# Altium schematic sheet 心形流水灯原理图.SchDoc
size A4
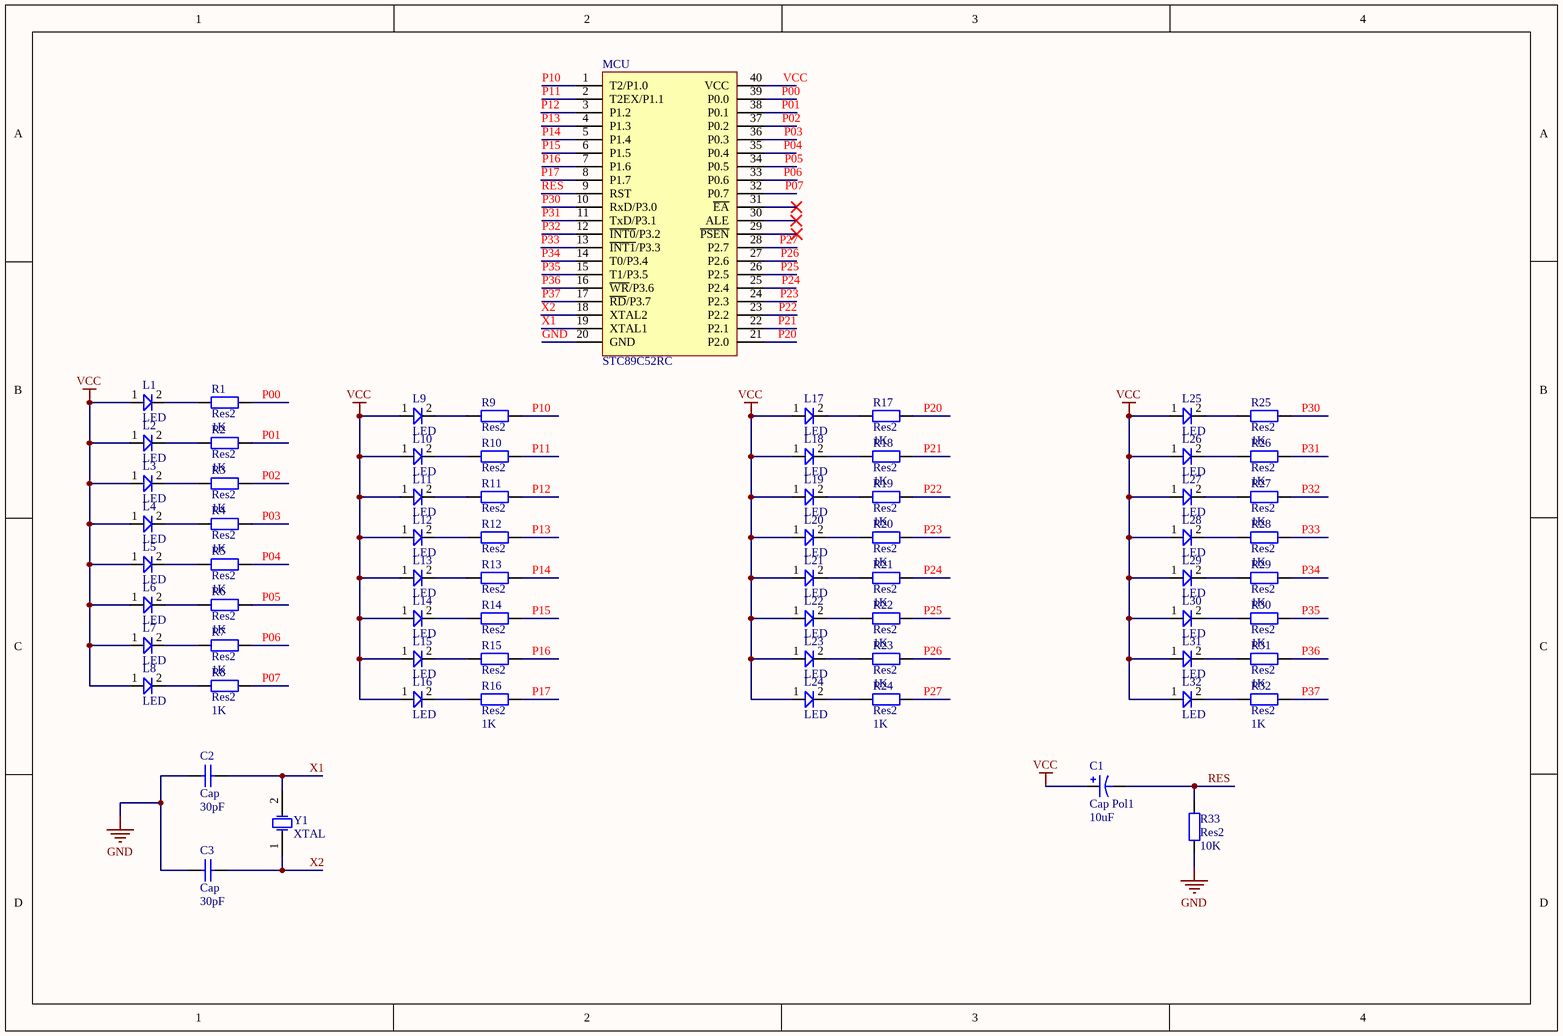
[diagram p0: 心形流水灯原理图.SchDoc]

## Parts
C1  Cap Pol1  value 10uF  [CAP-SMD_BD5.0-L5.3-W5.3-FD]
C2  Cap  value 30pF  [C0603]
C3  Cap  value 30pF  [C0603]
L1  LED  [LED-TH_BD5.6-P2.54-FD]
L2  LED  [LED-TH_BD5.6-P2.54-FD]
L3  LED  [LED-TH_BD5.6-P2.54-FD]
L4  LED  [LED-TH_BD5.6-P2.54-FD]
L5  LED  [LED-TH_BD5.6-P2.54-FD]
L6  LED  [LED-TH_BD5.6-P2.54-FD]
L7  LED  [LED-TH_BD5.6-P2.54-FD]
L8  LED  [LED-TH_BD5.6-P2.54-FD]
L9  LED  [LED-TH_BD5.6-P2.54-FD]
L10  LED  [LED-TH_BD5.6-P2.54-FD]
L11  LED  [LED-TH_BD5.6-P2.54-FD]
L12  LED  [LED-TH_BD5.6-P2.54-FD]
L13  LED  [LED-TH_BD5.6-P2.54-FD]
L14  LED  [LED-TH_BD5.6-P2.54-FD]
L15  LED  [LED-TH_BD5.6-P2.54-FD]
L16  LED  [LED-TH_BD5.6-P2.54-FD]
L17  LED  [LED-TH_BD5.6-P2.54-FD]
L18  LED  [LED-TH_BD5.6-P2.54-FD]
L19  LED  [LED-TH_BD5.6-P2.54-FD]
L20  LED  [LED-TH_BD5.6-P2.54-FD]
L21  LED  [LED-TH_BD5.6-P2.54-FD]
L22  LED  [LED-TH_BD5.6-P2.54-FD]
L23  LED  [LED-TH_BD5.6-P2.54-FD]
L24  LED  [LED-TH_BD5.6-P2.54-FD]
L25  LED  [LED-TH_BD5.6-P2.54-FD]
L26  LED  [LED-TH_BD5.6-P2.54-FD]
L27  LED  [LED-TH_BD5.6-P2.54-FD]
L28  LED  [LED-TH_BD5.6-P2.54-FD]
L29  LED  [LED-TH_BD5.6-P2.54-FD]
L30  LED  [LED-TH_BD5.6-P2.54-FD]
L31  LED  [LED-TH_BD5.6-P2.54-FD]
L32  LED  [LED-TH_BD5.6-P2.54-FD]
MCU  STC89C52RC  [DIP-40_L50.8-W17.8-P2.54-LS15.2-BL]
R1  Res2  value 1K  [R0603]
R2  Res2  value 1K  [R0603]
R3  Res2  value 1K  [R0603]
R4  Res2  value 1K  [R0603]
R5  Res2  value 1K  [R0603]
R6  Res2  value 1K  [R0603]
R7  Res2  value 1K  [R0603]
R8  Res2  value 1K  [R0603]
R9  Res2  [R0603]
R10  Res2  [R0603]
R11  Res2  [R0603]
R12  Res2  [R0603]
R13  Res2  [R0603]
R14  Res2  [R0603]
R15  Res2  [R0603]
R16  Res2  value 1K  [R0603]
R17  Res2  value 1K  [R0603]
R18  Res2  value 1K  [R0603]
R19  Res2  value 1K  [R0603]
R20  Res2  value 1K  [R0603]
R21  Res2  value 1K  [R0603]
R22  Res2  value 1K  [R0603]
R23  Res2  value 1K  [R0603]
R24  Res2  value 1K  [R0603]
R25  Res2  value 1K  [R0603]
R26  Res2  value 1K  [R0603]
R27  Res2  value 1K  [R0603]
R28  Res2  value 1K  [R0603]
R29  Res2  value 1K  [R0603]
R30  Res2  value 1K  [R0603]
R31  Res2  value 1K  [R0603]
R32  Res2  value 1K  [R0603]
R33  Res2  value 10K  [R0603]
Y1  XTAL  [HC-49S_L11.4-W4.8]

## Nets
GND: C2.1 C3.1 MCU.20(GND) R33.1
VCC: C1.1 L1.1 L2.1 L3.1 L4.1 L5.1 L6.1 L7.1 L8.1 L9.1 L10.1 L11.1 L12.1 L13.1 L14.1 L15.1 L16.1 L17.1 L18.1 L19.1 L20.1 L21.1 L22.1 L23.1 L24.1 L25.1 L26.1 L27.1 L28.1 L29.1 L30.1 L31.1 L32.1 MCU.40(VCC)
P00: MCU.39(P0.0) R1.2
P01: MCU.38(P0.1) R2.2
P02: MCU.37(P0.2) R3.2
P03: MCU.36(P0.3) R4.2
P04: MCU.35(P0.4) R5.2
P05: MCU.34(P0.5) R6.2
P06: MCU.33(P0.6) R7.2
P07: MCU.32(P0.7) R8.2
P10: MCU.1(T2/P1.0) R9.2
P11: MCU.2(T2EX/P1.1) R10.2
P12: MCU.3(P1.2) R11.2
P13: MCU.4(P1.3) R12.2
P14: MCU.5(P1.4) R13.2
P15: MCU.6(P1.5) R14.2
P16: MCU.7(P1.6) R15.2
P17: MCU.8(P1.7) R16.2
P20: MCU.21(P2.0) R17.2
P21: MCU.22(P2.1) R18.2
P22: MCU.23(P2.2) R19.2
P23: MCU.24(P2.3) R20.2
P24: MCU.25(P2.4) R21.2
P25: MCU.26(P2.5) R22.2
P26: MCU.27(P2.6) R23.2
P27: MCU.28(P2.7) R24.2
P30: MCU.10(RxD/P3.0) R25.2
P31: MCU.11(TxD/P3.1) R26.2
P32: MCU.12(~{INT0}/P3.2) R27.2
P33: MCU.13(~{INT1}/P3.3) R28.2
P34: MCU.14(T0/P3.4) R29.2
P35: MCU.15(T1/P3.5) R30.2
P36: MCU.16(~{WR}/P3.6) R31.2
P37: MCU.17(~{RD}/P3.7) R32.2
RES: C1.2 MCU.9(RST) R33.2
X1: C2.2 MCU.19(XTAL1) Y1.2(OSC2)
X2: C3.2 MCU.18(XTAL2) Y1.1(OSC1)
NetL1_2: L1.2 R1.1
NetL2_2: L2.2 R2.1
NetL3_2: L3.2 R3.1
NetL4_2: L4.2 R4.1
NetL5_2: L5.2 R5.1
NetL6_2: L6.2 R6.1
NetL7_2: L7.2 R7.1
NetL8_2: L8.2 R8.1
NetL9_2: L9.2 R9.1
NetL10_2: L10.2 R10.1
NetL11_2: L11.2 R11.1
NetL12_2: L12.2 R12.1
NetL13_2: L13.2 R13.1
NetL14_2: L14.2 R14.1
NetL15_2: L15.2 R15.1
NetL16_2: L16.2 R16.1
NetL17_2: L17.2 R17.1
NetL18_2: L18.2 R18.1
NetL19_2: L19.2 R19.1
NetL20_2: L20.2 R20.1
NetL21_2: L21.2 R21.1
NetL22_2: L22.2 R22.1
NetL23_2: L23.2 R23.1
NetL24_2: L24.2 R24.1
NetL25_2: L25.2 R25.1
NetL26_2: L26.2 R26.1
NetL27_2: L27.2 R27.1
NetL28_2: L28.2 R28.1
NetL29_2: L29.2 R29.1
NetL30_2: L30.2 R30.1
NetL31_2: L31.2 R31.1
NetL32_2: L32.2 R32.1

Not connected (* = marked no-connect by the designer): MCU 29(~{PSEN})* 30(ALE)* 31(~{EA})*

## Library data of the parts
C1 = Cap Pol1: Polarized Capacitor (Radial); Published: 8-Jun-2000; LatestRevisionDate: 17-Jul-2002; LatestRevisionNote: Re-released for DXP Platform.; PackageReference: RB7.6-15; Publisher: Altium Limited
C2 C3 = Cap: Capacitor; Published: 8-Jun-2000; LatestRevisionDate: 17-Jul-2002; LatestRevisionNote: Re-released for DXP Platform.; PackageReference: RAD-0.3; Publisher: Altium Limited
L1-L32 = LED_T
MCU = STC89C52RC: STC单片机; 版权归属: 源创客; BOM名称: STC单片机; 学习资源: www.ooocke.com
R1-R33 = Res2: Resistor; Published: 8-Jun-2000; LatestRevisionDate: 17-Jul-2002; LatestRevisionNote: Re-released for DXP Platform.; PackageReference: AXIAL-0.4; Publisher: Altium Limited
  R1-R32: PackageDescription: Axial Device, Thru-Hole; 2 Leads; 0.4 in Pin Spacing
Y1 = XTAL: Crystal Oscillator; Published: 8-Jun-2000; LatestRevisionDate: 17-Jul-2002; LatestRevisionNote: Re-released for DXP Platform.; PackageReference: R38; Publisher: Altium Limited